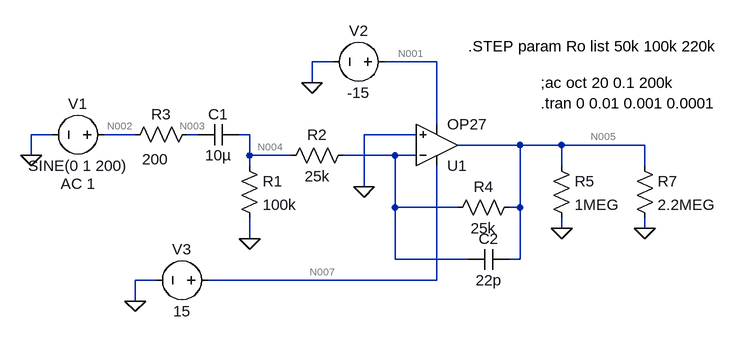
[diagram p0: schematic input filterasc.asc]
input filterasc.asc, the LTspice schematic file:
Version 4
SHEET 1 880 680
WIRE 96 -32 64 -32
WIRE 256 -32 176 -32
WIRE 64 0 64 -32
WIRE 256 64 256 -32
WIRE -336 80 -368 80
WIRE -208 80 -256 80
WIRE -112 80 -128 80
WIRE -32 80 -48 80
WIRE 224 80 144 80
WIRE 384 96 288 96
WIRE 448 96 384 96
WIRE 576 96 448 96
WIRE -368 112 -368 80
WIRE -32 112 -32 80
WIRE 32 112 -32 112
WIRE 192 112 112 112
WIRE 224 112 192 112
WIRE -32 128 -32 112
WIRE 448 128 448 96
WIRE 576 128 576 96
WIRE 144 160 144 80
WIRE 192 192 192 112
WIRE 288 192 192 192
WIRE 384 192 384 96
WIRE 384 192 368 192
WIRE 448 224 448 208
WIRE 576 224 576 208
WIRE -32 240 -32 208
WIRE 192 272 192 192
WIRE 304 272 192 272
WIRE 384 272 384 192
WIRE 384 272 368 272
WIRE -176 304 -208 304
WIRE 256 304 256 128
WIRE 256 304 -96 304
WIRE -208 336 -208 304
FLAG -368 112 0
FLAG -32 240 0
FLAG -208 336 0
FLAG 64 0 0
FLAG 448 224 0
FLAG 576 224 0
FLAG 144 160 0
SYMBOL voltage -240 80 R90
WINDOW 0 -32 56 VBottom 2
WINDOW 3 32 56 VTop 2
WINDOW 123 60 56 VTop 2
WINDOW 39 0 0 Left 2
SYMATTR InstName V1
SYMATTR Value SINE(0 1 200)
SYMATTR Value2 AC 1
SYMBOL Opamps\\OP27 256 160 M180
SYMATTR InstName U1
SYMBOL res -48 112 R0
SYMATTR InstName R1
SYMATTR Value 100k
SYMBOL cap -48 64 R90
WINDOW 0 0 32 VBottom 2
WINDOW 3 32 32 VTop 2
SYMATTR InstName C1
SYMATTR Value 10µ
SYMBOL voltage 192 -32 R90
WINDOW 0 -32 56 VBottom 2
WINDOW 3 32 56 VTop 2
WINDOW 123 0 0 Left 2
WINDOW 39 0 0 Left 2
SYMATTR InstName V2
SYMATTR Value -15
SYMBOL voltage -80 304 R90
WINDOW 0 -32 56 VBottom 2
WINDOW 3 32 56 VTop 2
WINDOW 123 0 0 Left 2
WINDOW 39 0 0 Left 2
SYMATTR InstName V3
SYMATTR Value 15
SYMBOL res 128 96 R90
WINDOW 0 0 56 VBottom 2
WINDOW 3 32 56 VTop 2
SYMATTR InstName R2
SYMATTR Value 25k
SYMBOL res -112 64 R90
WINDOW 0 0 56 VBottom 2
WINDOW 3 38 65 VTop 2
SYMATTR InstName R3
SYMATTR Value 200
SYMBOL res 384 176 R90
WINDOW 0 0 56 VBottom 2
WINDOW 3 32 56 VTop 2
SYMATTR InstName R4
SYMATTR Value 25k
SYMBOL cap 368 256 R90
WINDOW 0 0 32 VBottom 2
WINDOW 3 32 32 VTop 2
SYMATTR InstName C2
SYMATTR Value 22p
SYMBOL res 432 112 R0
SYMATTR InstName R5
SYMATTR Value 1MEG
SYMBOL res 560 112 R0
SYMATTR InstName R7
SYMATTR Value 2.2MEG
TEXT 304 -56 Left 2 !.STEP param Ro list 50k 100k 220k
TEXT 416 32 Left 2 !.tran 0 0.01 0.001 0.0001
TEXT 416 0 Left 2 !;ac oct 20 0.1 200k

The netlist it stands for:
* input filterasc.asc
V1 N002 0 SINE(0 1 200) AC 1
XU1 0 N006 N007 N001 N005 OP27  ; pins In+ In- V+ V- OUT
R1 N004 0 100k
C1 N004 N003 10µ
V2 N001 0 -15
V3 N007 0 15
R2 N006 N004 25k
R3 N003 N002 200
R4 N005 N006 25k
C2 N005 N006 22p
R5 N005 0 1MEG
R7 N005 0 2.2MEG
.STEP param Ro list 50k 100k 220k
.tran 0 0.01 0.001 0.0001
;ac oct 20 0.1 200k
.lib ADI.lib
.backanno
.end

* Results of the author's LTspice run, read from the files saved beside the schematic
* Operating Point (first step), zero values left out:
*   ro = 50 k
*   V(n007) = 15 V
*   V(n001) = -15 V
*   I(V3) = -2.666 mA
*   I(V2) = 2.666 mA
*   Ix(u1:3) = 2.666 mA
*   Ix(u1:4) = -2.666 mA
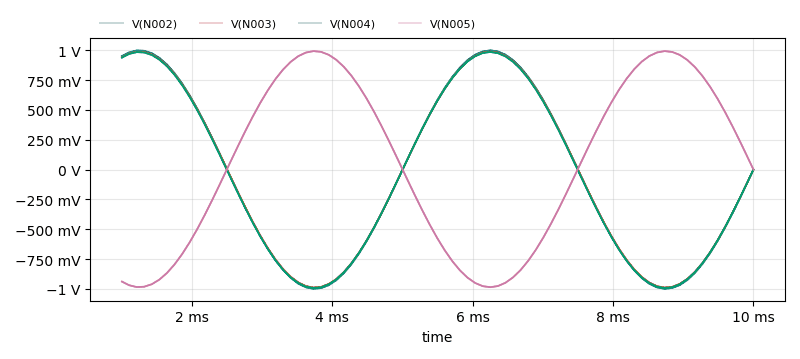
[diagram p1: Transient Analysis of input filterasc.asc, plotted from the saved traces]
* Transient Analysis, 5 runs:
*   V(N002) [run 1]: min -999.3 mV, max 999.5 mV, average -60.97 mV, rms 715.8 mV, last 0 V
*   V(N002) [run 2]: 951.1 mV at time=1 ms, 951.1 mV at time=1 ms, min 951.1 mV, max 951.1 mV
*   V(N002) [run 3]: min -999.3 mV, max 999.5 mV, average -60.97 mV, rms 715.8 mV, last 0 V
*   V(N002) [run 4]: 951.1 mV at time=1 ms, 951.1 mV at time=1 ms, min 951.1 mV, max 951.1 mV
*   V(N002) [run 5]: min -999.3 mV, max 999.5 mV, average -60.97 mV, rms 715.8 mV, last 0 V
*   V(N003) [run 1]: min -989.4 mV, max 989.6 mV, average -60.32 mV, rms 708.7 mV, last -1.775 µV
*   V(N003) [run 2]: 941.7 mV at time=1 ms, 941.7 mV at time=1 ms, min 941.7 mV, max 941.7 mV
*   V(N003) [run 3]: min -989.4 mV, max 989.6 mV, average -60.32 mV, rms 708.7 mV, last -1.775 µV
*   V(N003) [run 4]: 941.7 mV at time=1 ms, 941.7 mV at time=1 ms, min 941.7 mV, max 941.7 mV
*   V(N003) [run 5]: min -989.4 mV, max 989.6 mV, average -60.32 mV, rms 708.7 mV, last -1.775 µV
*   V(N004) [run 1]: min -993.2 mV, max 985.8 mV, average -64.48 mV, rms 708.8 mV, last 191.1 µV
*   V(N004) [run 2]: 939 mV at time=1 ms, 939 mV at time=1 ms, min 939 mV, max 939 mV
*   V(N004) [run 3]: min -993.2 mV, max 985.8 mV, average -64.48 mV, rms 708.8 mV, last 191.1 µV
*   V(N004) [run 4]: 939 mV at time=1 ms, 939 mV at time=1 ms, min 939 mV, max 939 mV
*   V(N004) [run 5]: min -993.2 mV, max 985.8 mV, average -64.48 mV, rms 708.8 mV, last 191.1 µV
*   V(N005) [run 1]: min -985.8 mV, max 993.2 mV, average 64.42 mV, rms 708.8 mV, last 527.3 µV
*   V(N005) [run 2]: -938.7 mV at time=1 ms, -938.7 mV at time=1 ms, min -938.7 mV, max -938.7 mV
*   V(N005) [run 3]: min -985.8 mV, max 993.2 mV, average 64.42 mV, rms 708.8 mV, last 527.3 µV
*   V(N005) [run 4]: -938.7 mV at time=1 ms, -938.7 mV at time=1 ms, min -938.7 mV, max -938.7 mV
*   V(N005) [run 5]: min -985.8 mV, max 993.2 mV, average 64.42 mV, rms 708.8 mV, last 527.3 µV